# EAGLE design Bus (EAGLE 7.3.0)
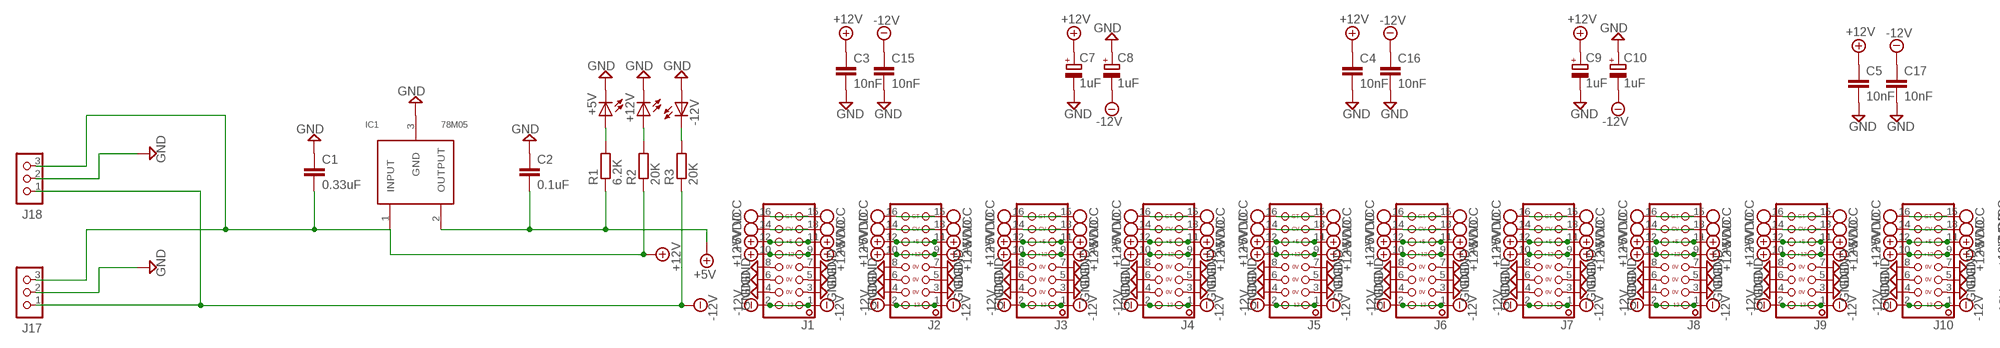
[diagram p0: schematic, sheet 1, part 1 of 2]
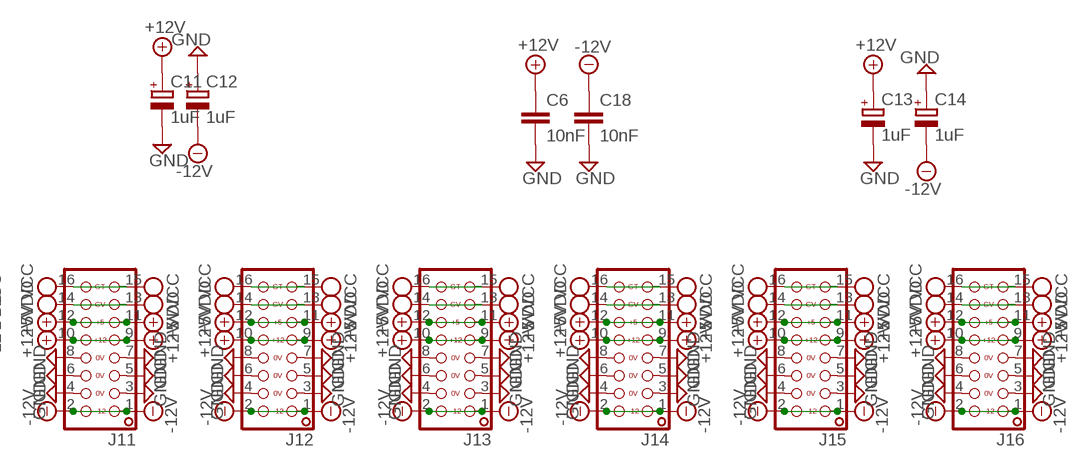
[diagram p1: schematic, sheet 1, part 2 of 2]

## Parts
+5V  LED3MM  [LED3MM]
+12V  LED3MM  [LED3MM]
-12V  LED3MM  [LED3MM]
C1  0.33uF  C-EUC1206  [C1206]
C2  0.1uF  C-EUC1206  [C1206]
C3  10nF  C-EUC1206  [C1206]
C4  10nF  C-EUC1206  [C1206]
C5  10nF  C-EUC1206  [C1206]
C6  10nF  C-EUC1206  [C1206]
C7  1uF  CPOL-EUA  [PANASONIC_A]
C8  1uF  CPOL-EUA  [PANASONIC_A]
C9  1uF  CPOL-EUA  [PANASONIC_A]
C10  1uF  CPOL-EUA  [PANASONIC_A]
C11  1uF  CPOL-EUA  [PANASONIC_A]
C12  1uF  CPOL-EUA  [PANASONIC_A]
C13  1uF  CPOL-EUA  [PANASONIC_A]
C14  1uF  CPOL-EUA  [PANASONIC_A]
C15  10nF  C-EUC1206  [C1206]
C16  10nF  C-EUC1206  [C1206]
C17  10nF  C-EUC1206  [C1206]
C18  10nF  C-EUC1206  [C1206]
IC1  78M05  78MXX  [TO252]
J1  EUROPWR_2X08-SHROUD  [2X08_EUROPWR_SHROUD]
J2  EUROPWR_2X08-SHROUD  [2X08_EUROPWR_SHROUD]
J3  EUROPWR_2X08-SHROUD  [2X08_EUROPWR_SHROUD]
J4  EUROPWR_2X08-SHROUD  [2X08_EUROPWR_SHROUD]
J5  EUROPWR_2X08-SHROUD  [2X08_EUROPWR_SHROUD]
J6  EUROPWR_2X08-SHROUD  [2X08_EUROPWR_SHROUD]
J7  EUROPWR_2X08-SHROUD  [2X08_EUROPWR_SHROUD]
J8  EUROPWR_2X08-SHROUD  [2X08_EUROPWR_SHROUD]
J9  EUROPWR_2X08-SHROUD  [2X08_EUROPWR_SHROUD]
J10  EUROPWR_2X08-SHROUD  [2X08_EUROPWR_SHROUD]
J11  EUROPWR_2X08-SHROUD  [2X08_EUROPWR_SHROUD]
J12  EUROPWR_2X08-SHROUD  [2X08_EUROPWR_SHROUD]
J13  EUROPWR_2X08-SHROUD  [2X08_EUROPWR_SHROUD]
J14  EUROPWR_2X08-SHROUD  [2X08_EUROPWR_SHROUD]
J15  EUROPWR_2X08-SHROUD  [2X08_EUROPWR_SHROUD]
J16  EUROPWR_2X08-SHROUD  [2X08_EUROPWR_SHROUD]
J17  CON_TERMINAL_BLOCK_03-5MM  [TERMINAL_BLOCK_3P_5]
J18  CON_TERMINAL_BLOCK_03-5MM  [TERMINAL_BLOCK_3P_5]
R1  6.2K  R-EU_R1206  [R1206]
R2  20K  R-EU_R1206  [R1206]
R3  20K  R-EU_R1206  [R1206]

## Nets
+5V: C2.2 IC1.2(OUTPUT) J1.11 J1.12 J2.11 J2.12 J3.11 J3.12 J4.11 J4.12 J5.11 J5.12 J6.11 J6.12 J7.11 J7.12 J8.11 J8.12 J9.11 J9.12 J10.11 J10.12 J11.11 J11.12 J12.11 J12.12 J13.11 J13.12 J14.11 J14.12 J15.11 J15.12 J16.11 J16.12 R1.1
+12V: C1.2 C3.1 C4.1 C5.1 C6.1 C7.+ C9.+ C11.+ C13.+ IC1.1(INPUT) J1.9 J1.10 J2.9 J2.10 J3.9 J3.10 J4.9 J4.10 J5.9 J5.10 J6.9 J6.10 J7.9 J7.10 J8.9 J8.10 J9.9 J9.10 J10.9 J10.10 J11.9 J11.10 J12.9 J12.10 J13.9 J13.10 J14.9 J14.10 J15.9 J15.10 J16.9 J16.10 J17.3 J18.3 R2.1
-12V: C8.- C10.- C12.- C14.- C15.1 C16.1 C17.1 C18.1 J1.1 J1.2 J2.1 J2.2 J3.1 J3.2 J4.1 J4.2 J5.1 J5.2 J6.1 J6.2 J7.1 J7.2 J8.1 J8.2 J9.1 J9.2 J10.1 J10.2 J11.1 J11.2 J12.1 J12.2 J13.1 J13.2 J14.1 J14.2 J15.1 J15.2 J16.1 J16.2 J17.1 J18.1 R3.1
MT: +5V.K(C) +12V.K(C) -12V.A C1.1 C2.1 C3.2 C4.2 C5.2 C6.2 C7.- C8.+ C9.- C10.+ C11.- C12.+ C13.- C14.+ C15.2 C16.2 C17.2 C18.2 IC1.3(GND) J1.3 J1.4 J1.5 J1.6 J1.7 J1.8 J2.3 J2.4 J2.5 J2.6 J2.7 J2.8 J3.3 J3.4 J3.5 J3.6 J3.7 J3.8 J4.3 J4.4 J4.5 J4.6 J4.7 J4.8 J5.3 J5.4 J5.5 J5.6 J5.7 J5.8 J6.3 J6.4 J6.5 J6.6 J6.7 J6.8 J7.3 J7.4 J7.5 J7.6 J7.7 J7.8 J8.3 J8.4 J8.5 J8.6 J8.7 J8.8 J9.3 J9.4 J9.5 J9.6 J9.7 J9.8 J10.3 J10.4 J10.5 J10.6 J10.7 J10.8 J11.3 J11.4 J11.5 J11.6 J11.7 J11.8 J12.3 J12.4 J12.5 J12.6 J12.7 J12.8 J13.3 J13.4 J13.5 J13.6 J13.7 J13.8 J14.3 J14.4 J14.5 J14.6 J14.7 J14.8 J15.3 J15.4 J15.5 J15.6 J15.7 J15.8 J16.3 J16.4 J16.5 J16.6 J16.7 J16.8 J17.2 J18.2 ; supply symbol labelled GND
N$79: +5V.A R1.2
N$80: +12V.A R2.2
N$81: -12V.K(C) R3.2
VCC: J1.15 J1.16 J2.15 J2.16 J3.15 J3.16 J4.15 J4.16 J5.15 J5.16 J6.15 J6.16 J7.15 J7.16 J8.15 J8.16 J9.15 J9.16 J10.15 J10.16 J11.15 J11.16 J12.15 J12.16 J13.15 J13.16 J14.15 J14.16 J15.15 J15.16 J16.15 J16.16
VDD: J1.13 J1.14 J2.13 J2.14 J3.13 J3.14 J4.13 J4.14 J5.13 J5.14 J6.13 J6.14 J7.13 J7.14 J8.13 J8.14 J9.13 J9.14 J10.13 J10.14 J11.13 J11.14 J12.13 J12.14 J13.13 J13.14 J14.13 J14.14 J15.13 J15.14 J16.13 J16.14

## Library data of the parts
+5V +12V -12V = led:LED: LED OSRAM: - CHIPLED LG R971, LG N971, LY N971, LG Q971, LY Q971, LO R971, LY R971 LH N974, LH R974 LS Q976, LO Q976, LY Q976 LO Q996 - Hyper CHIPLED LW Q18S LB Q993, LB Q99A, LB R99A - SideLED LS A670, LO A670, LY A670, LG A670, LP A670 LB A673, LV A673, LT A673, LW A673 LH A674 LY A675 LS A676, LA A676, LO A676, LY A676, LW A676 LS A679, LY A679, LG A679 - Hyper Micro SIDELED® LS Y876, LA Y876, LO Y876, LY Y876 LT Y87S - SmartLED LW L88C, LW L88S LB L89C, LB L89S, LG L890 LS L89K, LO L89K, LY L89K LS L896, LA L896, LO L896, LY L896 - TOPLED LS T670, LO T670, LY T670, LG T670, LP T670 LSG T670, LSP T670, LSY T670, LOP T670, LYG T670 LG T671, LOG T671, LSG T671 LB T673, LV T673, LT T673, LW T673 LH T674 LS T676, LA T676, LO T676, LY T676, LB T676, LH T676, LSB T676, LW T676 LB T67C, LV T67C, LT T67C, LS T67K, LO T67K, LY T67K, LW E67C LS E67B, LA E67B, LO E67B, LY E67B, LB E67C, LV E67C, LT E67C LW T67C LS T679, LY T679, LG T679 LS T770, LO T770, LY T770, LG T770, LP T770 LB T773, LV T773, LT T773, LW T773 LH T774 LS E675, LA E675, LY E675, LS T675 LS T776, LA T776, LO T776, LY T776, LB T776 LHGB T686 LT T68C, LB T68C - Hyper Mini TOPLED® LB M676 - Mini TOPLED Santana® LG M470 LS M47K, LO M47K, LY M47K Source: http://www.osram.convergy.de/
C1-C6 C15-C18 = Capacitors:C-EU: CAPACITOR, European symbol
C7-C14 = Capacitors:CPOL-EU: POLARIZED CAPACITOR, European symbol
IC1 = V Regs Convert:78MXX
J1-J16 = Jacks & Plugs:EUROPWR_2X08: 2x08 pin header
J17 J18 = dp_devices:CON_TERMINAL_BLOCK_03: 3 poles, wire to board connector
R1-R3 = Resistors:R-EU_: RESISTOR, European symbol

## Net classes
0 default: clearance 0.508 mm

## Board
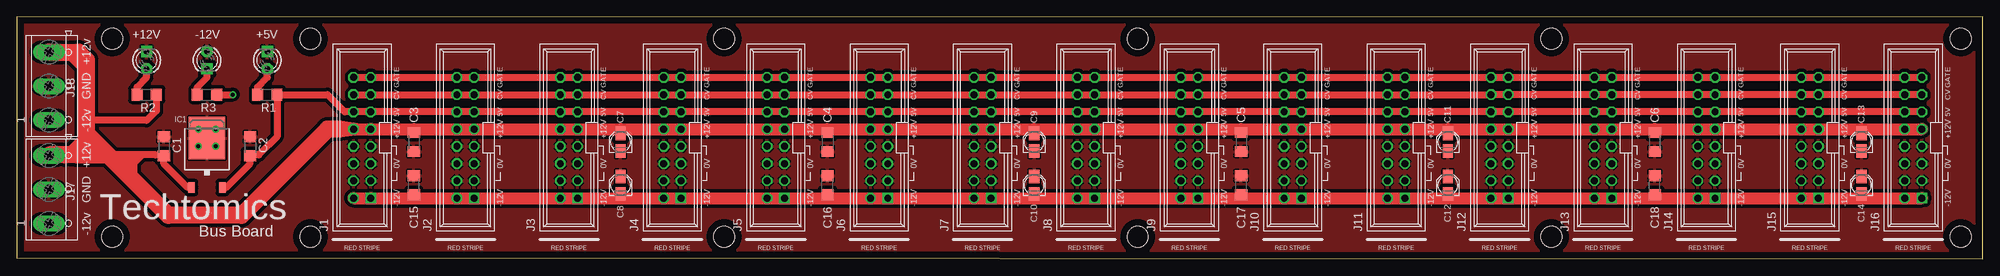
[diagram p2: board, top side]
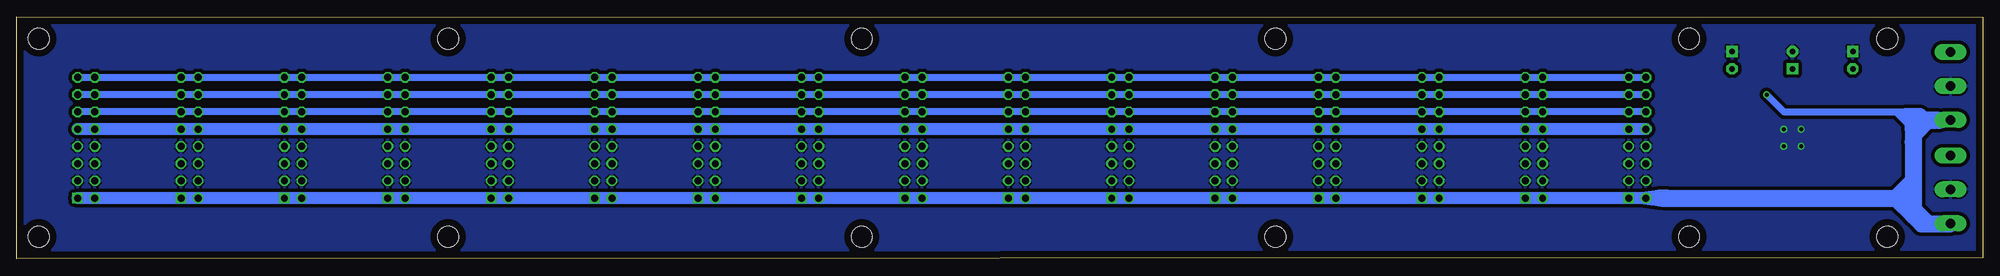
[diagram p3: board, bottom side, seen from below]

Size 289.68 x 35.61 mm. Coordinates in mm from the lower left corner, seen from the top.
Outline: 0,0.1 289.68,0 289.68,35.61 0,35.58 0,0.1
Copper layers (1*16): Top 0.035mm / dielectric 1.5mm / Bottom 0.035mm
Design rules "default": minimum track width 10mil, minimum drill 24mil, track to track 8mil, track to pad 8mil, pad to pad 8mil, via to via 8mil, smd to smd 8mil, copper to edge 40mil, drill to drill 8mil, minimum pad ring 10mil, minimum via ring 8mil, stop-mask expansion 4mil, vias tented up to drill 0mil, thermal gap 10mil
Holes 3.1 mm at 14.04,32.42 43.25,32.42 14.04,3.21 43.25,3.21 286.45,3.21 286.45,32.42 226.13,32.42 226.13,3.21 165.17,3.21 165.17,32.42 104.21,3.21 104.21,32.42

### Footprints (pad centres in the part's own frame; a part is rotated, then mirrored left to right if it is on the bottom)
LED3MM = drill 0.813 pad 1.676 octagon: A -1.27,0 | drill 0.813 pad 1.676 square: K 1.27,0
C1206 = smd 1.6 x 1.8: 1 -1.4,0; 2 1.4,0
PANASONIC_A = smd 2 x 1.5: + 1.3,0; - -1.3,0
TO252 = smd 1 x 1.6: 1 -2.28,-6.07; 2 2.28,-6.07 | smd 5.4 x 6.2: 3 0,1.23
2X08_EUROPWR_SHROUD = drill 1.016 square: 1 -8.89,-1.27 | drill 1.016 octagon: 2 -8.89,1.27; 3 -6.35,-1.27; 4 -6.35,1.27; 5 -3.81,-1.27; 6 -3.81,1.27; 7 -1.27,-1.27; 8 -1.27,1.27; 9 1.27,-1.27; 10 1.27,1.27; 11 3.81,-1.27; 12 3.81,1.27; 13 6.35,-1.27; 14 6.35,1.27; 15 8.89,-1.27; 16 8.89,1.27
TERMINAL_BLOCK_3P_5 = drill 1.4 pad 2.38 long: 1 5,-0.45; 2 0,-0.45; 3 -5,-0.45
R1206 = smd 1.6 x 1.803: 1 -1.422,0; 2 1.422,0

### Placement (x,y rotation side)
+5V  36.9,29.24 90 top
+12V  19.12,29.24 90 top
-12V  28.01,29.24 270 top
C1  21.66,16.54 270 top
C2  34.36,16.54 270 top
C3  58.49,17.18 270 top
C4  119.45,17.18 270 top
C5  180.41,17.18 270 top
C6  241.37,17.18 270 top
C7  88.97,17.18 90 top
C8  88.97,10.83 90 top
C9  149.93,17.18 90 top
C10  149.93,10.83 90 top
C11  210.89,17.18 90 top
C12  210.89,10.83 90 top
C13  271.85,17.18 90 top
C14  271.85,10.83 90 top
C15  58.49,10.83 90 top
C16  119.45,10.83 90 top
C17  180.41,10.83 90 top
C18  241.37,10.83 90 top
IC1  28.01,16.54 0 top
J1  50.87,17.81 90 top
J2  66.11,17.81 90 top
J3  81.35,17.81 90 top
J4  96.59,17.81 90 top
J5  111.83,17.81 90 top
J6  127.07,17.81 90 top
J7  142.31,17.81 90 top
J8  157.55,17.81 90 top
J9  172.79,17.81 90 top
J10  188.03,17.81 90 top
J11  203.27,17.81 90 top
J12  218.51,17.81 90 top
J13  233.75,17.81 90 top
J14  248.99,17.81 90 top
J15  264.23,17.81 90 top
J16  279.47,17.81 90 top
J17  5.15,10.19 270 top
J18  5.15,25.43 270 top
R1  36.9,24.16 180 top
R2  19.12,24.16 180 top
R3  28.01,24.16 180 top

### Tracks (layer width: path | path; a pad name or v marks a point on that pad's centre or on a via)
+5V
  Top 1.016: J16.11 J1.12 48.33,21.62 45.79,24.16 R1.1 38.32,17.97 35.63,15.27 34.49,15.27 C2.2 34.36,14 30.83,10.47 IC1.2
  Bottom 1.016: J1.12 J1.11 J2.12 J2.11 J3.12 J3.11 J4.12 J4.11 J5.12 J5.11 J6.12 J6.11 J7.12 J7.11 J8.12 J8.11 J9.12 J9.11 J10.12 J10.11 J11.12 J11.11 J12.12 J12.11 J13.12 J13.11 J14.12 J14.11 J15.12 J15.11 J16.12 J16.11
+12V
  Top 1.016: 15.44,13.87 14.8,14.51 | 14.04,15.27 7.05,15.27 10.23,18.45 10.23,15.91 12.77,15.91 11.82,16.86 10.86,17.81 | 14.04,15.27 10.23,19.08 | 14.04,15.27 14.8,14.51 | 14.8,14.51 8.7,14.51 | R2.1 20.54,21.78 19.12,20.35 10.23,20.35 | C3.1 58.49,19.08 | C7.+ 88.97,19.08 | C4.1 119.45,19.08 | C9.+ 149.93,19.08 | C5.1 180.41,19.08 | C11.+ 210.89,19.08 | C6.1 241.37,19.08 | C13.+ 271.85,19.08 | 18.48,15.27 20.39,15.27 C1.2 21.66,14 25.19,10.47 IC1.1 | 18.48,15.27 17.85,15.27 | 17.85,15.27 17.21,15.27 | 17.21,15.27 16.58,15.27 | 15.94,15.27 14.04,15.27 | 16.58,12.73 16.58,13.37 | 16.58,13.37 16.58,14 | 16.58,14 16.58,15.27 | 16.58,15.27 15.94,15.27 | 15.94,15.27 15.94,14 | 16.58,14 17.85,15.27 | 17.21,15.27 17.21,12.1 | 18.48,15.27 16.58,13.37 | 7.05,30.51 10.23,27.34
  Top 1.27: J1.9 47.06,19.72 | J1.9 47.06,18.45 | J1.9 47.69,19.72 | 47.69,19.72 47.69,18.45 | 47.69,18.45 J1.9 | 47.69,18.45 47.06,18.45 | 47.06,18.45 47.06,19.72 | 47.06,19.72 47.69,19.72
  Top 1.778: J16.9 271.85,19.08 241.37,19.08 210.89,19.08 180.41,19.08 149.93,19.08 119.45,19.08 88.97,19.08 58.49,19.08 J1.9 J1.10 47.06,19.08
  Top 2.54: J18.3 9.04,30.43 10.23,29.24 10.23,27.34 10.23,20.35 10.23,19.08 10.23,18.45 | 10.23,18.45 10.23,16.54 8.96,15.27 7.05,15.27 4.78,15.27 J17.3 | 47.06,19.08 45.79,19.08 33.09,6.38 22.29,6.38 11.82,16.86 10.23,18.45
  Bottom 1.778: J1.10 J1.9 J2.10 J2.9 J3.10 J3.9 J4.10 J4.9 J5.10 J5.9 J6.10 J6.9 J7.10 J7.9 J8.10 J8.9 J9.10 J9.9 J10.10 J10.9 | J10.9 190.57,19.08 | J10.9 J11.10 J11.9 J12.10 J12.9 J13.10 J13.9 J14.10 J14.9 J15.10 J15.9 J16.10 J16.9
-12V  (via drill 0.6)
  Top 0.406: C14.- 271.85,8.92 | C12.- 210.89,8.92 | 149.93,10.19 C10.- 149.93,8.92 | C8.- 88.97,8.92
  Top 1.016: R3.1 v31.82,24.16 | C15.1 58.49,8.92 | C16.1 119.45,8.92 | C17.1 180.41,8.92 | C18.1 241.37,8.92
  Top 1.778: J1.2 J1.1 58.49,8.92 88.97,8.92 119.45,8.92 149.93,8.92 180.41,8.92 210.89,8.92 241.37,8.92 271.85,8.92 J16.1
  Bottom 0.406: 46.98,9.99 47.31,9.99 J1.1 47.31,7.86 47.03,7.86
  Bottom 1.016: 6.42,20.35 4.78,20.35 J18.1 | 47.31,9.69 47.69,9.56 J1.2 47.69,8.29 47.31,8.16 | 12.77,21.62 29.28,21.62 v31.82,24.16 | 12.77,21.62 11.5,21.62 | 11.5,21.62 10.86,20.99 9.59,19.72 | 11.5,21.62 8.32,20.99 | 12.77,21.62 10.23,19.08 | 7.69,20.35 8.96,21.62 11.5,21.62 | 7.05,5.11 10.23,8.29 | 7.05,20.35 10.23,17.18
  Bottom 1.27: 10.86,19.08 10.86,20.99 | 47.69,9.56 J1.1 47.69,8.29 | 45.79,8.29 47.69,8.29 | 47.69,8.29 47.69,9.56 | 47.69,9.56 46.42,9.56
  Bottom 1.778: 47.06,8.92 J1.2 J1.1 J2.2 J2.1 J3.2 J3.1 J4.2 J4.1 J5.2 J5.1 J6.2 J6.1 J7.2 J7.1 J8.2 J8.1 J9.2 J9.1 J10.2 J10.1 J11.2 J11.1 J12.2 J12.1 J13.2 J13.1 J14.2 J14.1 J15.2 J15.1 J16.2 J16.1
  Bottom 2.54: 47.06,8.92 12.77,8.92 | 12.77,8.92 10.23,6.38 | 10.23,6.38 8.96,5.11 7.05,5.11 4.78,5.11 J17.1 | 6.42,20.35 7.05,20.35 7.69,20.35 8.96,20.35 9.59,19.72 10.23,19.08 10.23,17.18 10.23,11.46 | 10.23,11.46 10.23,8.92 | 10.23,8.92 10.23,8.29 10.23,6.38 | 12.77,8.92 10.23,8.92 | 10.23,11.46 12.77,8.92
MT  (via drill 0.6)
  other vias: 26.74,19.08 29.28,19.08 26.74,16.54 29.28,16.54
  pour Bottom: -1.2,36.86 290.9,36.86 290.9,-1.24 -1.2,-1.24
  pour Top: -1.2,36.86 290.9,36.86 290.9,-1.24 -1.2,-1.24
N$1
  Top 1.016: 14.04,14.64 8.96,14.64
N$79
  Top 1.016: R1.2 35.48,25.28 36.9,26.7 +5V.A
N$80
  Top 1.016: R2.2 17.7,25.28 19.12,26.7 +12V.A
N$81
  Top 1.016: R3.2 26.59,25.28 28.01,26.7 -12V.K
VCC
  Top 1.016: J1.16 J1.15 J2.16 J2.15 J3.16 J3.15 J4.16 J4.15 J5.16 J5.15 J6.16 J6.15 J7.16 J7.15 J8.16 J8.15 J9.16 J9.15 J10.16 J10.15 J11.16 J11.15 J12.16 J12.15 J13.16 J13.15 J14.16 J14.15 J15.16 J15.15 J16.16 J16.15
  Bottom 1.016: J16.15 J1.16
VDD
  Top 1.016: J1.14 J1.13 J2.14 J2.13 J3.14 J3.13 J4.14 J4.13 J5.14 J5.13 J6.14 J6.13 J7.14 J7.13 J8.14 J8.13 J9.14 J9.13 J10.14 J10.13 J11.14 J11.13 J12.14 J12.13 J13.14 J13.13 J14.14 J14.13 J15.14 J15.13 J16.14 J16.13
  Bottom 1.016: J1.14 J16.13

### Text on the board
tPlace: +12v | GND | -12v | +12v | GND | Techtomics | -12v | Bus Board